# EAGLE board OBC_manufactured (EAGLE 9.7.0)
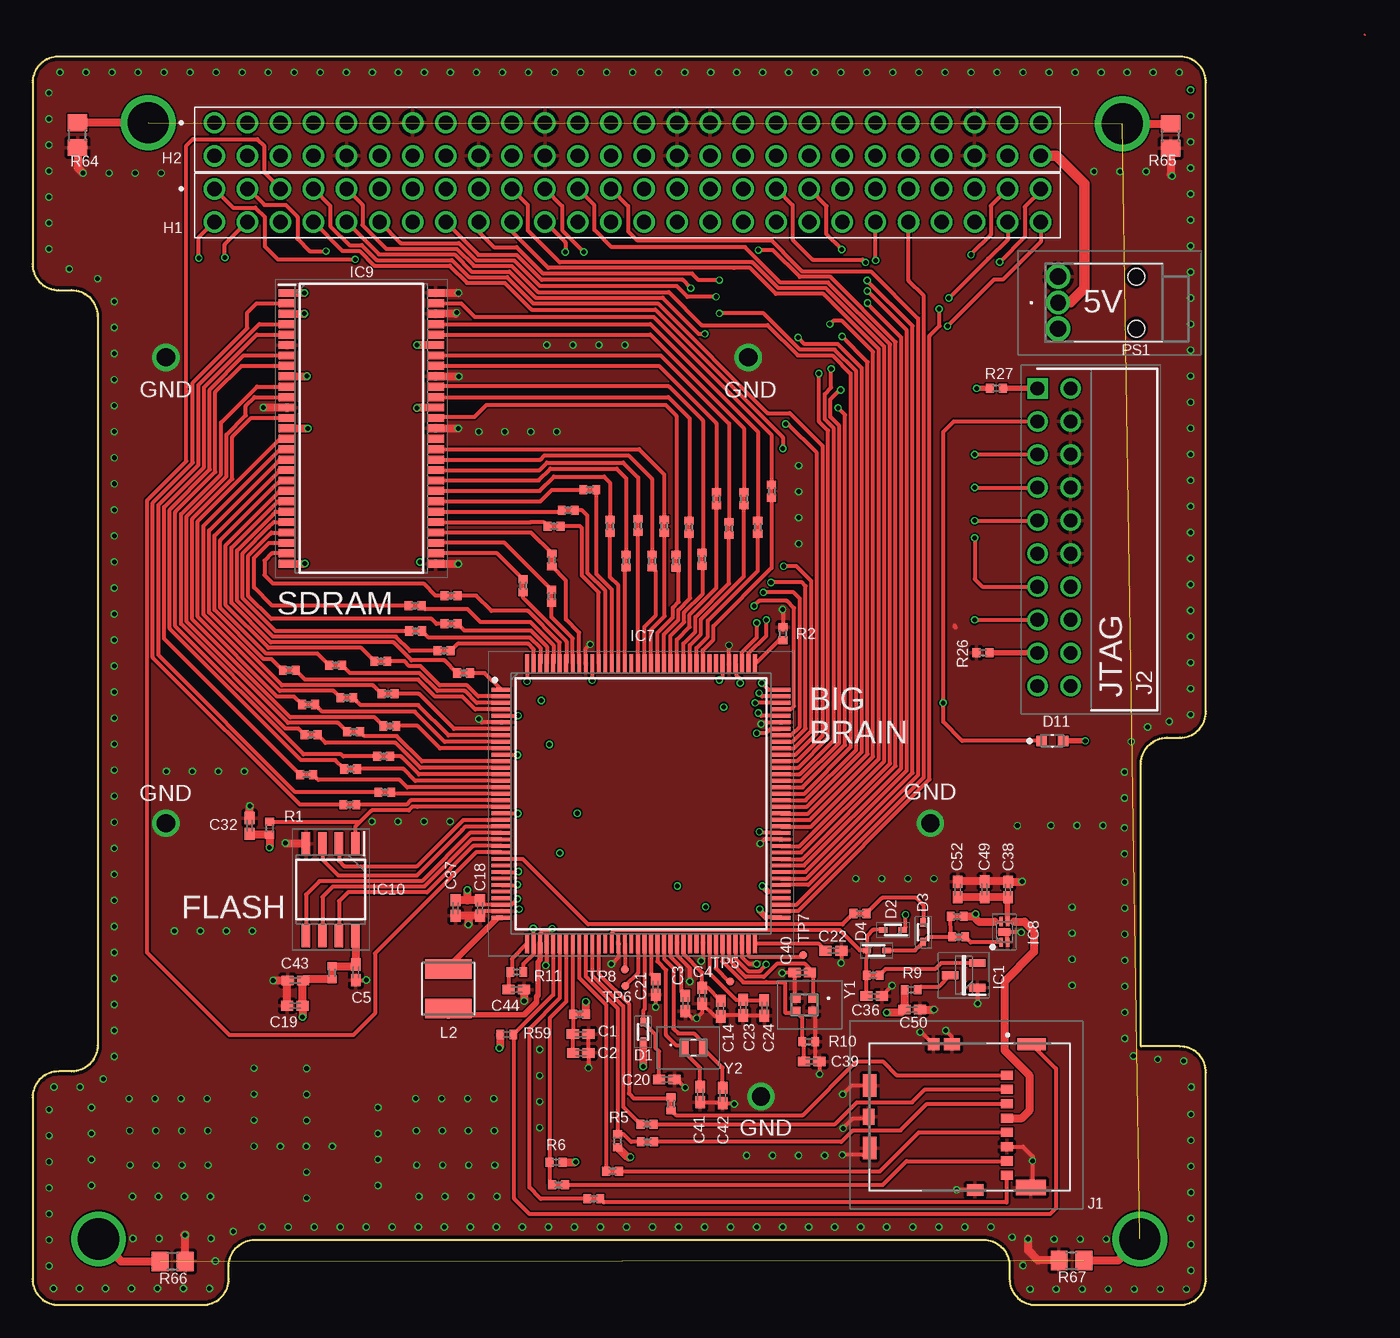
[diagram p5: board, top side]
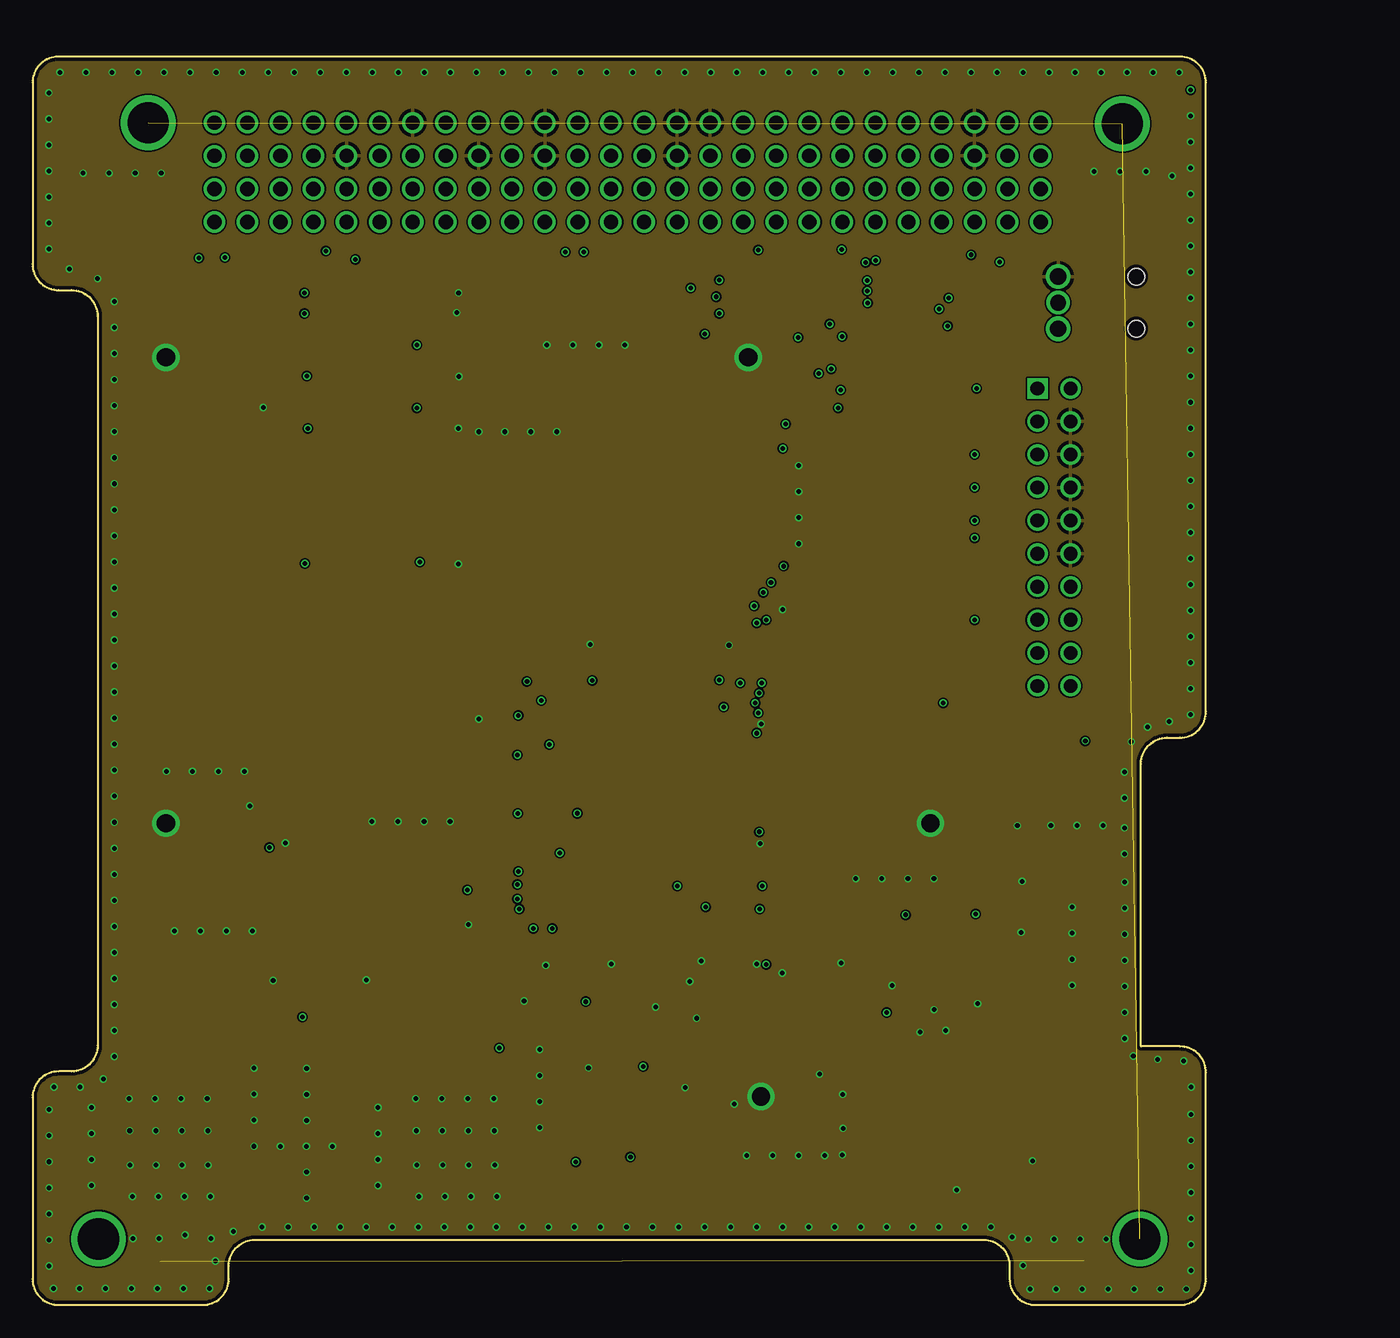
[diagram p6: board, inner layer Route2]
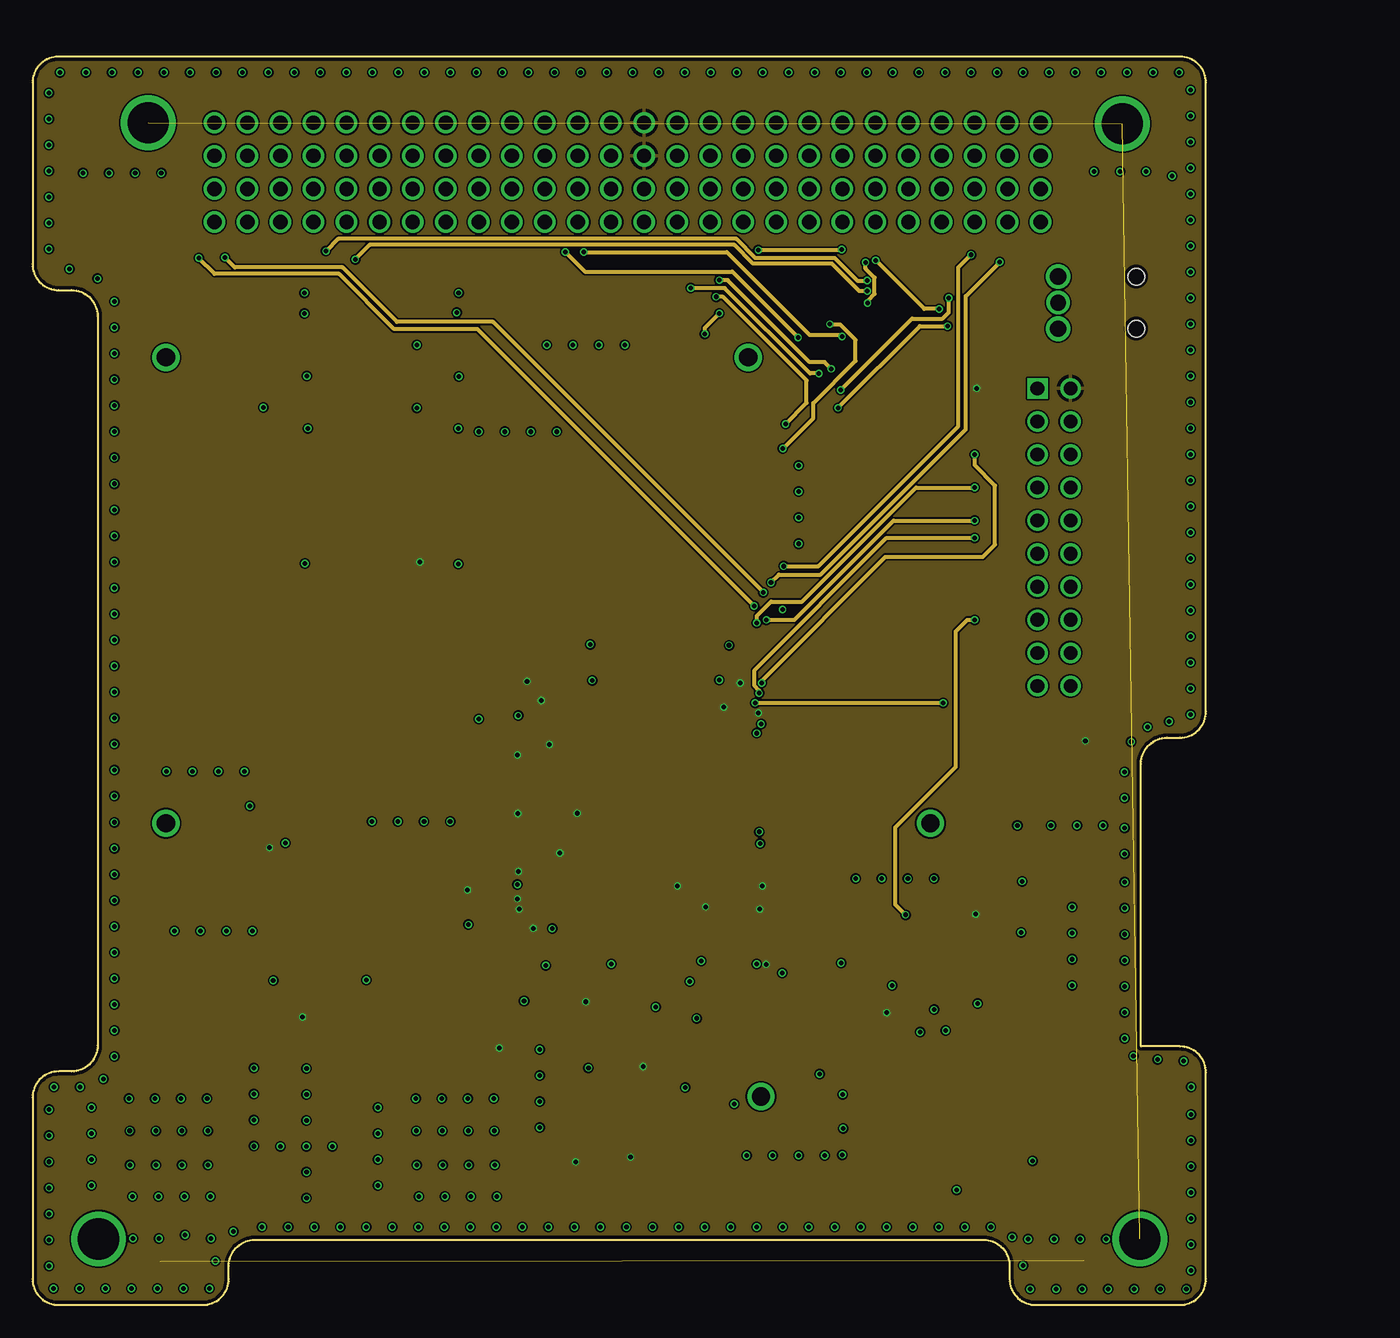
[diagram p7: board, inner layer Route15]
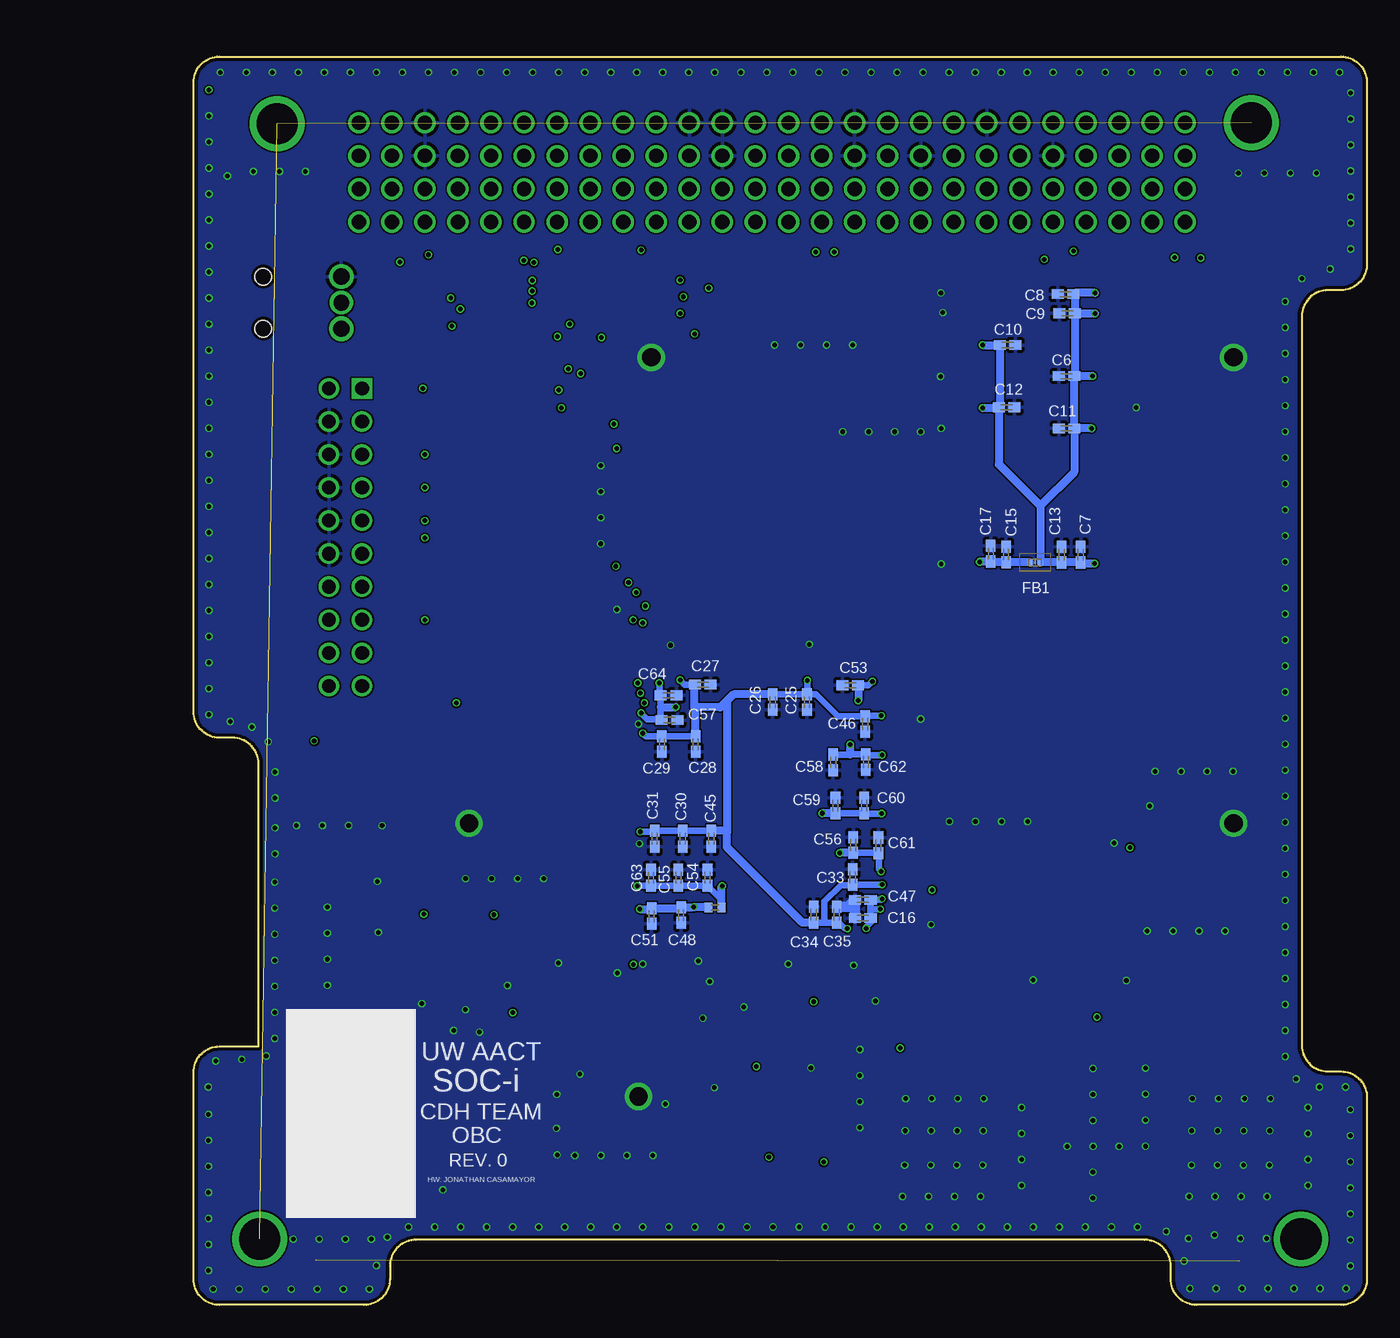
[diagram p8: board, bottom side, seen from below]

Size 90.17 x 95.89 mm. Coordinates in mm from the lower left corner, seen from the top.
Outline: 85.17,19.86 85.17,41.57 arc-90 87.17,43.57 88.17,43.57 arc90 90.17,45.57 90.17,93.89 arc90 88.17,95.89 2,95.89 arc90 0,93.89 0,79.95 arc90 2,77.95 3,77.95 arc-90 5,75.95 5,19.94 arc-90 3,17.94 2,17.94 arc90 0,15.94 0,2 arc90 2,0 13.08,0 arc90 15.08,2 15.08,3 arc-90 17.08,5 73.08,5 arc-90 75.08,3 75.08,2 arc90 77.08,0 88.17,0 arc90 90.17,2 90.17,17.86 arc90 88.17,19.86 85.17,19.86
Copper layers (1*2*15*16): Top 0.035mm / dielectric 0.23mm / Route2 0.035mm / dielectric 0.93mm / Route15 0.035mm / dielectric 0.23mm / Bottom 0.035mm
Design rules "MF_Standard_4_Layer": minimum track width 5mil, minimum drill 10mil, track to track 5mil, track to pad 5mil, pad to pad 5mil, via to via 5mil, smd to smd 0mil, copper to edge 10mil, drill to drill 10mil, minimum pad ring 4mil, minimum via ring 4mil, stop-mask expansion 2mil, vias tented up to drill 25mil, thermal gap 10mil

## Footprints (pad centres in the part's own frame; a part is rotated, then mirrored left to right if it is on the bottom)
C0402K = smd 0.925 x 0.74: 1 -0.6,0; 2 0.6,0
SODFL1608X70N = smd 0.64 x 0.42: 1 -0.75,0; 2 0.75,0
KINGBRIGHT_KPT-1608SGC_0 = smd 0.8 x 0.8: 1 -0.825,0; 2 0.825,0
NFZ15SG152SN10B = smd 0.4 x 0.5: 1 -0.4,0; 2 0.4,0
SAMTEC_ESQ-126-39-G-D = drill 1.1: 1 0,0; 2 0,-2.54; 3 2.54,0; 4 2.54,-2.54; 5 5.08,0; 6 5.08,-2.54; 7 7.62,0; 8 7.62,-2.54; 9 10.16,0; 10 10.16,-2.54; 11 12.7,0; 12 12.7,-2.54; 13 15.24,0; 14 15.24,-2.54; 15 17.78,0; 16 17.78,-2.54; 17 20.32,0; 18 20.32,-2.54; 19 22.86,0; 20 22.86,-2.54; 21 25.4,0; 22 25.4,-2.54; 23 27.94,0; 24 27.94,-2.54; 25 30.48,0; 26 30.48,-2.54; 27 33.02,0; 28 33.02,-2.54; 29 35.56,0; 30 35.56,-2.54; 31 38.1,0; 32 38.1,-2.54; 33 40.64,0; 34 40.64,-2.54; 35 43.18,0; 36 43.18,-2.54; 37 45.72,0; 38 45.72,-2.54; 39 48.26,0; 40 48.26,-2.54; 41 50.8,0; 42 50.8,-2.54; 43 53.34,0; 44 53.34,-2.54; 45 55.88,0; 46 55.88,-2.54; 47 58.42,0; 48 58.42,-2.54; 49 60.96,0; 50 60.96,-2.54; 51 63.5,0; 52 63.5,-2.54
SOT95P237X112-3N = smd 1.25 x 0.6: 1 -1.05,0.95; 2 -1.05,-0.95; 3 1.05,0
QFP50P2200X2200X160-144N = smd 1.475 x 0.3: 1 -10.738,8.75; 2 -10.738,8.25; 3 -10.738,7.75; 4 -10.738,7.25; 5 -10.738,6.75; 6 -10.738,6.25; 7 -10.738,5.75; 8 -10.738,5.25; 9 -10.738,4.75; 10 -10.738,4.25; 11 -10.738,3.75; 12 -10.738,3.25; 13 -10.738,2.75; 14 -10.738,2.25; 15 -10.738,1.75; 16 -10.738,1.25; 17 -10.738,0.75; 18 -10.738,0.25; 19 -10.738,-0.25; 20 -10.738,-0.75; 21 -10.738,-1.25; 22 -10.738,-1.75; 23 -10.738,-2.25; 24 -10.738,-2.75; 25 -10.738,-3.25; 26 -10.738,-3.75; 27 -10.738,-4.25; 28 -10.738,-4.75; 29 -10.738,-5.25; 30 -10.738,-5.75; 31 -10.738,-6.25; 32 -10.738,-6.75; 33 -10.738,-7.25; 34 -10.738,-7.75; 35 -10.738,-8.25; 36 -10.738,-8.75; 73 10.738,-8.75; 74 10.738,-8.25; 75 10.738,-7.75; 76 10.738,-7.25; 77 10.738,-6.75; 78 10.738,-6.25; 79 10.738,-5.75; 80 10.738,-5.25; 81 10.738,-4.75; 82 10.738,-4.25; 83 10.738,-3.75; 84 10.738,-3.25; 85 10.738,-2.75; 86 10.738,-2.25; 87 10.738,-1.75; 88 10.738,-1.25; 89 10.738,-0.75; 90 10.738,-0.25; 91 10.738,0.25; 92 10.738,0.75; 93 10.738,1.25; 94 10.738,1.75; 95 10.738,2.25; 96 10.738,2.75; 97 10.738,3.25; 98 10.738,3.75; 99 10.738,4.25; 100 10.738,4.75; 101 10.738,5.25; 102 10.738,5.75; 103 10.738,6.25; 104 10.738,6.75; 105 10.738,7.25; 106 10.738,7.75; 107 10.738,8.25; 108 10.738,8.75 | smd 0.3 x 1.475: 37 -8.75,-10.738; 38 -8.25,-10.738; 39 -7.75,-10.738; 40 -7.25,-10.738; 41 -6.75,-10.738; 42 -6.25,-10.738; 43 -5.75,-10.738; 44 -5.25,-10.738; 45 -4.75,-10.738; 46 -4.25,-10.738; 47 -3.75,-10.738; 48 -3.25,-10.738; 49 -2.75,-10.738; 50 -2.25,-10.738; 51 -1.75,-10.738; 52 -1.25,-10.738; 53 -0.75,-10.738; 54 -0.25,-10.738; 55 0.25,-10.738; 56 0.75,-10.738; 57 1.25,-10.738; 58 1.75,-10.738; 59 2.25,-10.738; 60 2.75,-10.738; 61 3.25,-10.738; 62 3.75,-10.738; 63 4.25,-10.738; 64 4.75,-10.738; 65 5.25,-10.738; 66 5.75,-10.738; 67 6.25,-10.738; 68 6.75,-10.738; 69 7.25,-10.738; 70 7.75,-10.738; 71 8.25,-10.738; 72 8.75,-10.738; 109 8.75,10.738; 110 8.25,10.738; 111 7.75,10.738; 112 7.25,10.738; 113 6.75,10.738; 114 6.25,10.738; 115 5.75,10.738; 116 5.25,10.738; 117 4.75,10.738; 118 4.25,10.738; 119 3.75,10.738; 120 3.25,10.738; 121 2.75,10.738; 122 2.25,10.738; 123 1.75,10.738; 124 1.25,10.738; 125 0.75,10.738; 126 0.25,10.738; 127 -0.25,10.738; 128 -0.75,10.738; 129 -1.25,10.738; 130 -1.75,10.738; 131 -2.25,10.738; 132 -2.75,10.738; 133 -3.25,10.738; 134 -3.75,10.738; 135 -4.25,10.738; 136 -4.75,10.738; 137 -5.25,10.738; 138 -5.75,10.738; 139 -6.25,10.738; 140 -6.75,10.738; 141 -7.25,10.738; 142 -7.75,10.738; 143 -8.25,10.738; 144 -8.75,10.738
SON50P160X120X60-5N = smd 0.7 x 0.3: 1 -0.8,0.25; 2 -0.8,-0.25; 3 0.8,-0.25; 4 0.8,0.25 | smd 0.55 x 0.91: 5 0,0
SOP80P1176X120-54N = smd 1.27 x 0.6: 1 -5.715,10.4; 2 -5.715,9.6; 3 -5.715,8.8; 4 -5.715,8; 5 -5.715,7.2; 6 -5.715,6.4; 7 -5.715,5.6; 8 -5.715,4.8; 9 -5.715,4; 10 -5.715,3.2; 11 -5.715,2.4; 12 -5.715,1.6; 13 -5.715,0.8; 14 -5.715,0; 15 -5.715,-0.8; 16 -5.715,-1.6; 17 -5.715,-2.4; 18 -5.715,-3.2; 19 -5.715,-4; 20 -5.715,-4.8; 21 -5.715,-5.6; 22 -5.715,-6.4; 23 -5.715,-7.2; 24 -5.715,-8; 25 -5.715,-8.8; 26 -5.715,-9.6; 27 -5.715,-10.4; 28 5.715,-10.4; 29 5.715,-9.6; 30 5.715,-8.8; 31 5.715,-8; 32 5.715,-7.2; 33 5.715,-6.4; 34 5.715,-5.6; 35 5.715,-4.8; 36 5.715,-4; 37 5.715,-3.2; 38 5.715,-2.4; 39 5.715,-1.6; 40 5.715,-0.8; 41 5.715,0; 42 5.715,0.8; 43 5.715,1.6; 44 5.715,2.4; 45 5.715,3.2; 46 5.715,4; 47 5.715,4.8; 48 5.715,5.6; 49 5.715,6.4; 50 5.715,7.2; 51 5.715,8; 52 5.715,8.8; 53 5.715,9.6; 54 5.715,10.4
SOIC127P790X216-8N = smd 1.785 x 0.65: 1 -3.532,1.905; 2 -3.532,0.635; 3 -3.532,-0.635; 4 -3.532,-1.905; 5 3.532,-1.905; 6 3.532,-0.635; 7 3.532,0.635; 8 3.532,1.905
5040771891 = smd 0.7 x 0.95: 1 -2.847,2.887; 2 -1.747,2.887; 3 -0.647,2.887; 4 0.453,2.887; 5 1.553,2.887; 6 2.653,2.887; 7 3.753,2.887; 8 4.853,2.887 | smd 0.95 x 2.17: 9 -5.222,4.787 | smd 1.19 x 2.3: 10 5.798,4.722 | smd 0.88 x 1.25: 11 5.963,0.447 | smd 1.7 x 1.03: 12 2.753,-7.663; 13 -2.047,-7.663 | smd 1.2 x 0.88: 14 0.353,-7.738 | smd 0.95 x 1.2: 15 -5.222,-1.338 | smd 0.9 x 0.9: 16 -5.222,-2.748
RHDRRA20W60P254X254_2X10_2590X = drill 1.05 pad 1.575 square: 1 0,0 | drill 1.05 pad 1.575: 2 0,2.54; 3 2.54,0; 4 2.54,2.54; 5 5.08,0; 6 5.08,2.54; 7 7.62,0; 8 7.62,2.54; 9 10.16,0; 10 10.16,2.54; 11 12.7,0; 12 12.7,2.54; 13 15.24,0; 14 15.24,2.54; 15 17.78,0; 16 17.78,2.54; 17 20.32,0; 18 20.32,2.54; 19 22.86,0; 20 22.86,2.54
SRN4026 = smd 1.5 x 3.6: 1 -1.525,0; 2 1.525,0
PJ040D = drill 1.209 pad 1.768: 1 6,-3 | drill 1.26 pad 1.768: 2 6,-5; 3 6,-1 | hole 1.3: 0,-5; 0,-1
R0402 = smd 0.6 x 0.7: 1 -0.5,0; 2 0.5,0
R0805 = smd 1.3 x 1.5: 1 -0.95,0; 2 0.95,0
TP06R = smd 0.6 x 0.6: TP 0,0
XRCGB24M000F2P01R0 = smd 0.75 x 0.7: 1 -0.675,-0.5; 2 0.675,-0.5; 3 0.675,0.5; 4 -0.675,0.5
ECS327712TR = smd 0.6 x 1.1: 1 -0.7,0; 2 0.7,0

## Placement (x,y rotation side)
C1  0.1uF  [C0402K]  42.11,20.8 180 top
C2  4.7uF  [C0402K]  42.14,19.35 180 top
C3  1.0 uF  [C0402K]  50.16,23.16 90 top
C4  0.1uF  [C0402K]  51.46,23.75 90 top
C5  1.0uF  [C0402K]  24.84,25.55 90 top
C6  4.7uF  [C0402K]  23.09,71.35 180 bottom
C7  0.1uF  [C0402K]  22,57.63 90 bottom
C8  0.1uF  [C0402K]  23.16,77.65 180 bottom
C9  0.1uF  [C0402K]  23.04,76.17 180 bottom
C10  0.1uF  [C0402K]  27.61,73.74 0 bottom
C11  0.1uF  [C0402K]  23.09,67.34 180 bottom
C12  0.1uF  [C0402K]  27.69,68.96 0 bottom
C13  0.1uF  [C0402K]  23.47,57.63 90 bottom
C14  10 uF  [C0402K]  52.88,22.76 90 top
C15  1.0uF  [C0402K]  27.74,57.66 270 bottom
C16  0.22uF  [C0402K]  38.73,29.72 0 bottom
C17  0.1uF  [C0402K]  28.91,57.71 270 bottom
C18  4.7uF  [C0402K]  34.39,30.48 90 top
C19  0.22uF  [C0402K]  20.17,22.99 0 top
C20  0.22uF  [C0402K]  48.74,17.32 180 top
C21  0.22uF  [C0402K]  47.88,24.43 90 top
C22  0.22uF  [C0402K]  61.54,27.2 180 top
C23  0.1uF  [C0402K]  54.61,22.83 90 top
C24  4.7uF  [C0402K]  56.24,22.81 90 top
C25  0.22uF  [C0402K]  43.03,46.3 90 bottom
C26  0.22uF  [C0402K]  45.67,46.3 90 bottom
C27  0.22uF  [C0402K]  51.03,47.65 180 bottom
C28  0.22uF  [C0402K]  51.59,43.08 90 bottom
C29  0.22uF  [C0402K]  54.18,43.08 90 bottom
C30  0.22uF  [C0402K]  52.58,35.81 90 bottom
C31  0.22uF  [C0402K]  54.74,35.81 90 bottom
C32  0.1uF  [C0402K]  16.69,36.8 270 top
C33  0.22uF  [C0402K]  39.52,32.87 270 bottom
C34  0.22uF  [C0402K]  42.52,29.97 270 bottom
C35  4.7uF  [C0402K]  40.74,29.97 270 bottom
C36  0.1uF  [C0402K]  64.67,23.72 180 top
C37  0.1uF  [C0402K]  32.51,30.48 90 top
C38  0.1uF  [C0402K]  74.96,31.9 270 top
C39  4.7pF  [C0402K]  59.87,18.69 180 top
C40  4.7pF  [C0402K]  59.13,25.53 0 top
C41  10pF  [C0402K]  51.31,16.15 90 top
C42  10pF  [C0402K]  53.04,16.08 90 top
C43  0.1uF  [C0402K]  20.19,24.92 0 top
C44  0.22uF  [C0402K]  37.19,24.23 180 top
C45  0.22uF  [C0402K]  50.39,35.81 90 bottom
C46  0.22uF  [C0402K]  38.56,44.63 90 bottom
C47  0.22uF  [C0402K]  38.73,31.11 0 bottom
C48  0.22uF  [C0402K]  52.7,29.95 90 bottom
C49  4.7uF  [C0402K]  73.15,31.93 270 top
C50  1.0uF  [C0402K]  67.59,22.68 180 top
C51  4.7uF  [C0402K]  54.97,29.87 90 bottom
C52  4.7uF  [C0402K]  71.09,31.9 270 top
C53  0.1uF  [C0402K]  39.7,47.6 0 bottom
C54  0.1uF  [C0402K]  50.67,32.82 270 bottom
C55  0.1uF  [C0402K]  52.91,32.82 270 bottom
C56  0.1uF  [C0402K]  39.47,35.33 270 bottom
C57  0.1uF  [C0402K]  53.59,44.93 180 bottom
C58  0.1uF  [C0402K]  41.02,41.68 90 bottom
C59  0.1uF  [C0402K]  40.84,38.35 270 bottom
C60  4.7uF  [C0402K]  38.63,38.35 270 bottom
C61  4.7uF  [C0402K]  37.54,35.31 270 bottom
C62  4.7uF  [C0402K]  38.51,41.71 90 bottom
C63  4.7uF  [C0402K]  55.02,32.82 270 bottom
C64  4.7uF  [C0402K]  53.67,46.84 180 bottom
D1  BAT54XV2T1G  [SODFL1608X70N]  46.91,20.98 270 top
D2  BAT54XV2T1G  [SODFL1608X70N]  66.12,28.8 180 top
D3  BAT54XV2T1G  [SODFL1608X70N]  68.45,28.63 270 top
D4  BAT54XV2T1G  [SODFL1608X70N]  64.87,27.23 0 top
D11  KINGBRIGHT_KPT-1608SGCKINGBRIGHT_KPT-1608SGC_0_0  [KINGBRIGHT_KPT-1608SGC_0]  78.36,43.33 0 top
FB1  BLM15AG121SN1D  [NFZ15SG152SN10B]  25.5,57.05 0 bottom
H1  ESQ-126-39-G-D  [SAMTEC_ESQ-126-39-G-D]  13.97,85.73 0 top
H2  ESQ-126-39-G-D  [SAMTEC_ESQ-126-39-G-D]  13.97,90.81 0 top
IC1  TPS3839L30DBZR  [SOT95P237X112-3N]  71.55,25.32 180 top
IC7  MIMXRT1021DAG5A  [QFP50P2200X2200X160-144N]  46.76,38.51 0 top
IC8  MIC94300YMT-TR  [SON50P160X120X60-5N]  74.68,28.65 90 top
IC9  IS42S16160J-6TL  [SOP80P1176X120-54N]  25.27,67.34 0 top
IC10  IS25LP064A-JBLE  [SOIC127P790X216-8N]  22.91,31.9 270 top
J1  504077-1891  [5040771891]  71.98,14.81 270 top
J2  PPPC102LJBN-RC  [RHDRRA20W60P254X254_2X10_2590X]  77.22,70.41 270 top
L2  SRN4026-4R7M  [SRN4026]  31.95,24.28 90 top
PS1  PJ-040D  [PJ040D]  84.81,73.99 180 top
R1  10k Ohm  [R0402]  18.21,36.63 90 top
R2  10k Ohm  [R0402]  57.66,51.56 270 top
R3  0 Ohm  [R0402]  42.04,22.33 180 top
R4  0 Ohm  [R0402]  23.01,25.53 90 top
R5  10k Ohm  [R0402]  44.96,12.62 90 top
R6  10k Ohm  [R0402]  40.23,10.97 180 top
R7  0 Ohm  [R0402]  63.58,30.07 0 top
R8  0 Ohm  [R0402]  64.59,25.32 180 top
R9  1k Ohm  [R0402]  67.51,24.21 0 top
R10  2.2M Ohm  [R0402]  59.64,20.22 0 top
R11  30k Ohm  [R0402]  37.21,25.58 0 top
R12  0 Ohm  [R0402]  56.79,62.51 90 top
R13  0 Ohm  [R0402]  55.73,59.74 90 top
R14  0 Ohm  [R0402]  54.66,61.93 90 top
R15  0 Ohm  [R0402]  53.52,59.64 90 top
R16  0 Ohm  [R0402]  52.55,61.93 90 top
R17  0 Ohm  [R0402]  51.44,57.28 90 top
R18  0 Ohm  [R0402]  50.44,59.74 90 top
R19  0 Ohm  [R0402]  49.45,57.12 90 top
R20  0 Ohm  [R0402]  48.54,59.82 90 top
R21  0 Ohm  [R0402]  47.6,57.15 90 top
R22  0 Ohm  [R0402]  46.53,59.87 90 top
R23  0 Ohm  [R0402]  45.62,57.15 90 top
R24  0 Ohm  [R0402]  44.37,59.82 90 top
R25  0 Ohm  [R0402]  42.82,62.61 180 top
R26  100 Ohm  [R0402]  73.03,50.09 180 top
R27  100 Ohm  [R0402]  74.07,70.41 0 top
R28  0 Ohm  [R0402]  41.17,61.04 180 top
R29  0 Ohm  [R0402]  40.08,59.82 180 top
R30  0 Ohm  [R0402]  39.9,57.23 90 top
R31  0 Ohm  [R0402]  39.88,54.43 90 top
R32  0 Ohm  [R0402]  37.69,55.24 90 top
R33  0 Ohm  [R0402]  24.38,38.43 0 top
R34  0 Ohm  [R0402]  27.08,39.4 0 top
R35  0 Ohm  [R0402]  21.06,40.74 0 top
R36  0 Ohm  [R0402]  24.43,41.17 0 top
R37  0 Ohm  [R0402]  26.97,42.14 0 top
R38  0 Ohm  [R0402]  21.41,43.79 0 top
R39  0 Ohm  [R0402]  24.66,44.02 0 top
R40  0 Ohm  [R0402]  27.46,44.48 0 top
R41  0 Ohm  [R0402]  21.21,46.13 0 top
R42  0 Ohm  [R0402]  24.16,46.63 0 top
R43  0 Ohm  [R0402]  27.33,46.94 0 top
R44  0 Ohm  [R0402]  19.74,48.74 0 top
R45  0 Ohm  [R0402]  23.29,49.15 0 top
R46  0 Ohm  [R0402]  26.77,49.45 0 top
R47  0 Ohm  [R0402]  33.12,48.54 0 top
R48  0 Ohm  [R0402]  31.62,50.24 0 top
R49  0 Ohm  [R0402]  29.44,51.77 0 top
R50  0 Ohm  [R0402]  32.16,52.32 0 top
R51  0 Ohm  [R0402]  29.39,53.72 0 top
R52  0 Ohm  [R0402]  32.16,54.48 0 top
R53  0 Ohm  [R0402]  49.07,15.44 270 top
R54  0 Ohm  [R0402]  47.22,13.89 0 top
R55  0 Ohm  [R0402]  47.24,12.52 0 top
R56  0 Ohm  [R0402]  44.58,10.26 0 top
R57  0 Ohm  [R0402]  40.41,9.22 0 top
R58  0 Ohm  [R0402]  43.13,8.15 0 top
R59  10k Ohm  [R0402]  36.45,20.78 180 top
R60  0 Ohm  [R0402]  71.17,28.27 0 top
R61  0 Ohm  [R0402]  71.04,29.84 0 top
R62  0 Ohm  [R0402]  50.09,30.53 180 bottom
R64  1 MOhm  [R0805]  3.45,89.86 90 top
R65  1 MOhm  [R0805]  87.45,89.79 90 top
R66  1 MOhm  [R0805]  10.77,3.35 180 top
R67  1 MOhm  [R0805]  79.83,3.43 0 top
TP5  TPTP06R  [TP06R]  53.59,24.84 90 top
TP6  TPTP06R  [TP06R]  45.54,24.51 0 top
TP7  TPTP06R  [TP06R]  59.21,26.9 0 top
TP8  TPTP06R  [TP06R]  45.52,25.78 0 top
Y1  XRCGB24M000F2P01R0  [XRCGB24M000F2P01R0]  59.31,23.06 180 top
Y2  ECS-.327-7-12-TR  [ECS327712TR]  50.8,19.76 0 top

## Tracks (layer width: path | path; a pad name or v marks a point on that pad's centre or on a via)
3V3_BUS  (via drill 0.35)
  Top 0.305: IC7.34 | R11.2 37.71,26.18 38.52,26.99 IC7.38 38.51,28.9 v38.48,28.93 | 42.54,23.27 v42.52,23.29 | 41.71,10.97 v41.73,11 | v56.36,26.16 56.21,26.01 56.21,25.96 55.88,25.64 54.98,25.64 54.02,26.6 54.02,27.76 IC7.69 54.01,27.64 | R59.2 35.92,20.75 | 35.92,19.8 v35.87,19.74 | 72.08,29.84 72.29,29.84 | 67.01,22.71 C50.2 66.76,22.45 | IC8.4 73.93,29.45 73.91,29.44 | IC7.34 34.72,30.76 C18.2 | IC7.73 57.47,29.78 56.35,29.78 | v37.26,31.19 36.83,30.76 IC7.34 | IC8.1 72.09,27.85 R60.2 R60.1 | D4.2 67.81,27.23 D3.2 68.85,28.27 R60.1 | R60.1 70.55,28.39 R61.1 R61.2 | IC7.44 41.51,22.35 R3.2 | R3.2 41.54,20.83 C1.2 41.51,19.38 C2.2 | IC7.11 37.25,42.26 v37.26,42.24 | R3.1 R3.2 | 18.2,36.12 R1.1 | IC7.77 56.51,31.76 | IC7.29 37.3,33.26 v37.34,33.3 | IC7.20 37.27,37.76 v37.29,37.74 | IC7.144 38.01,47.92 v38,47.9 | IC7.112 54.07,49.18 54.07,48.4 54.38,48.09 v54.38,47.78 | IC7.104 55.99,45.26 v55.78,45.47
  Top 0.406: 56.51,31.76 v56.08,32.18 | R27.1 v72.55,70.41 | v80.9,43.33 D11.2
  Top 0.508: 56.35,29.78 55.88,30.25 v55.88,30.4
  Top 0.61: R3.1 42.54,23.27 | R5.1 45.73,11.35 v45.95,11.35 | R6.1 41.71,10.97 | D1.2 v46.91,18.31 | 35.92,20.75 35.92,19.8 | R61.2 72.08,29.84 | v72.47,30.02 72.29,29.84 72.68,29.45 73.93,29.45 | R9.1 67.01,22.71 | 66.76,22.45 v65.63,22.45 | C18.2 33.43,31.08 | 33.43,31.08 C37.2 | 33.43,31.08 v33.43,31.88 | v20.75,22.12 20.77,22.14 C19.2 20.77,24.89 C43.2 20.9,25.03 R4.1 R4.2 24.72,26.03 C5.2 | C5.2 24.77,26.09 | IC10.8 24.82,26.18 C5.2 | v18.21,35.13 R1.1 16.77,36.13 C32.2
  Bottom 0.305: 27.73,57.05 C15.2 | 28.85,57.06 C17.2 | v29.77,57.07 29.73,57.11 | 55.03,30.4 C51.2 | 52.78,30.47 C48.2 | 51.75,30.55 v51.71,30.58 | 37.34,31.11 v37.26,31.19 | 38.13,30.4 38.12,30.4 | 38.44,42.24 C62.2 | 38.21,47.7 38.2,47.7
  Bottom 0.406: C16.2 38.1,29.68 38.1,29.41 | v38.48,28.93 38.48,29.03
  Bottom 0.508: 38.48,29.03 38.1,29.41 | C16.2 38.13,30.4 C47.2 37.34,31.11 | 38.12,30.4 v37.39,30.4 | R62.1 49.59,31.13 C54.2 C55.2 C63.2 56.05,32.22 v56.08,32.18 56.07,32.18 | C56.2 37.57,34.73 C61.2 37.52,34.68 37.52,33.48 v37.34,33.3 37.34,33.33 | C59.2 C60.2 v37.29,37.74 | v37.26,42.24 38.44,42.24 | C62.2 39.7,42.31 | C58.2 39.7,42.28 | 54.27,45.01 54.27,45.92 C64.2 54.37,46.94 54.37,47.77 v54.38,47.78 54.38,47.74 | 54.27,45.01 C57.2 | v38,47.9 38.2,47.7 | 55.77,45.47 v55.78,45.47 55.32,45.01 54.27,45.01 | C53.2 38.31,47.6 38.21,47.7
  Bottom 0.61: FB1.1 27.73,57.05 | C15.2 28.85,57.06 | 29.73,57.11 C17.2 | v55.88,30.4 55.03,30.4 | C51.2 52.78,30.47 | C48.2 51.75,30.55 50.6,30.55 R62.2 | 39.7,42.28 39.7,42.31 39.7,43.03 v39.73,43.05 | C53.2 v39.09,46.43 | R62.1 49.59,32.15 v49.55,32.18 | 54.27,45.92 v53.11,45.92 | C59.2 41.84,37.75 v41.86,37.77 | C56.2 40.5,34.73 v40.51,34.72
  pour Route15: 389 corners
5V_USB
  Top 0.61: PS1.1 78.84,77.02
  Top 0.813: 78.84,77.02 79.75,77.02 80.82,78.08 80.82,86.11 78.66,88.27 H2.52
5V_USB_OTG
  Top 0.305: IC7.59 49.01,26.76 49.84,25.93 49.84,24.09 C3.2
ANT_BURN_WIRE1
  Top 0.305: IC7.83 57.51,34.77 59.06,34.77 65.89,41.59 65.89,73.79 61.14,78.54 57.48,78.54 54.76,81.25 44.5,81.25 43.18,82.58 43.18,84.46 H1.23
ANT_BURN_WIRE2
  Top 0.305: IC7.78 59.62,32.27 68.05,40.7 68.05,75.77 64.41,79.4 59.13,79.4 57.68,80.85 57.68,80.89 56.79,81.79 46.46,81.79 45.77,82.47 45.77,84.41 H1.25
CHASSIS  (via drill 3.18)  (3 unrouted)
  Top 0.61: v5.08,5.08 6.81,3.35 R66.2 | v85.09,5.08 83.41,3.4 80.81,3.4 R67.2 | v83.74,90.73 R65.2 | v8.89,90.81 R64.2
DCDC_OUT  (via drill 0.35)
  Top 0.305: v39.93,28.91 39.81,28.79 39.25,28.79 39.01,28.55 IC7.39 | IC7.86 55.95,36.26 v55.85,36.35 | IC7.102 57.43,44.19 56.65,44.19 56.38,43.92 v55.65,43.92 | IC7.31 37.23,32.26 v37.26,32.28 | IC7.5 v37.31,45.26 | IC7.134 43.01,47.99 v43,47.98 | IC7.114 53.01,48.24 v52.78,48.01
  Top 0.406: IC7.39 39.01,26.51 38.84,26.34 38.84,23.78 38.73,23.67 38.73,23.26 37.77,22.29 31.95,22.29
  Top 0.61: 31.95,22.29 L2.1
  Bottom 0.305: 54.8,36.35 C31.2 | 38.52,45.26 C46.2 | 43,46.93 C25.2
  Bottom 0.406: v39.93,28.91 40.1,28.91 40.56,29.37 C35.2
  Bottom 0.508: C35.2 41.68,29.37 | 41.68,29.37 C34.2 | v55.85,36.35 54.8,36.35 | C31.2 C30.2 C45.2 | v55.65,43.92 55.41,43.68 C29.2 C28.2 | v37.26,32.28 38.11,32.28 C33.2 39.54,32.25 40.44,32.25 41.68,31 41.68,29.37 | v37.31,45.26 38.52,45.26 | v43,47.98 43,46.93 | C26.2 C25.2 42.33,46.9 40.66,45.23 C46.2 | v52.78,48.01 52.43,47.65 C27.2
  Bottom 0.61: C28.2 51.59,45.9 | C27.2 51.69,47.59 51.69,45.9 51.59,45.9 | C26.2 48.68,46.9 49.19,46.39 | 51.59,45.9 49.68,45.9 49.19,46.39 | C34.2 43.4,29.37 49.19,35.16 49.19,36.23 | C45.2 50.38,36.42 49.38,36.42 49.19,36.23 | 49.19,46.39 49.19,36.23
DTR
  Top 0.305: IC7.26 34.08,34.76 26.31,27 26.31,22.4 24.64,20.73 15.14,20.73 8.81,27.05 8.81,61.82 11.81,64.81 11.81,89.05 12.32,89.56 17.27,89.56 17.78,89.05 17.78,87 H1.5
FLEXSPI_CLK
  Top 0.305: IC7.24 33.73,35.76 30.1,32.13 23.06,32.13 22.28,31.34 IC10.6
FLEXSPI_D0_A
  Top 0.305: IC7.23 33.62,36.26 29.92,32.56 22.05,32.56 21.01,31.52 IC10.5
FLEXSPI_D1_A
  Top 0.305: IC10.2 23.55,34.11 23.95,33.71 29.57,33.71 33.12,37.26 IC7.21
FLEXSPI_D2_A
  Top 0.305: IC10.3 22.28,34.21 23.5,32.99 29.54,32.99 32.99,36.45 32.99,36.47 33.28,36.76 IC7.22
FLEXSPI_D3_A
  Top 0.305: IC7.25 33.86,35.26 30.3,31.7 24.23,31.7 23.55,31.01 IC10.7
FLEXSPI_SS0
  Top 0.305: IC7.19 29.56,38.26 29.54,38.28 29.19,38.28 28.91,38 26.06,38 25.34,37.27 25.19,37.13 | IC10.1 24.82,36.75 25.19,37.13 | R1.2 25.19,37.13
GND  (via drill 0.35, 1.4)
  Top 0.305: IC7.135 42.51,50.41 v42.85,50.75 | 32.54,76.19 32.55,76.19 v32.59,76.22 | 32.73,77.73 v32.74,77.75 | 32.7,56.94 v32.72,56.92 | v57.63,53.42 57.66,53.39 R2.1 | IC7.113 v53.51,50.67 v53.52,50.67 | IC7.6 34.54,44.76 v34.29,45.01 | v17.73,68.94 | 19.48,35.43 v19.43,35.48 | C5.1 25.64,24.95 v25.65,24.97 | 37.79,23.36 v37.77,23.34 | IC8.2 74.93,28.4 IC8.5 75.95,28.65 v75.97,28.63 | C38.1 74.98,32.53 | C49.1 73.18,32.55 | C1.1 42.74,20.78 C2.1 42.74,18.23 v42.72,18.21 | IC7.51 45.01,26.72 v44.48,26.19 | C21.1 v47.88,22.89 | 51.28,15.58 C41.1 52.96,15.55 C42.1 53.89,15.48 v53.92,15.44 | IC7.60 49.53,27.75 49.53,26.86 50.49,25.89 v50.49,24.84 | IC7.70 54.5,26.73 54.91,26.32 55.03,26.2 v55.65,26.2 | C20.1 49.51,17.32 v50.14,16.69 | C3.1 50.71,22.02 v51.03,22.02 51.46,22.45 C4.1 52.45,22.16 C14.1 52.96,22.23 C23.1 54.63,22.21 C24.1 | IC7.64 51.51,26.54 v51.38,26.42 | Y1.4 60.14,22.41 R10.2 60.14,19.02 C39.1 60.47,17.74 v60.48,17.73 | Y1.2 58.53,23.67 C40.1 57.63,25.53 v57.61,25.5 | J1.13 62.93,16.86 v62.26,16.18 | J1.14 64.09,14.3 63.02,14.3 v62.28,13.56 | J1.12 63.8,11.53 v62.23,11.53 | J1.10 76.83,9.14 v76.83,11.07 76.83,11.43 76.11,12.15 J1.6 | J1.11 v71.02,8.85 v71.02,8.84 | J1.16 68.31,20.95 v68.2,20.95 | J1.15 70.65,20.62 v70.18,21.08 | IC7.40 39.51,26.15 v39.45,26.09 | C22.1 62.14,26.28 v62.13,26.26 | 71.12,32.53 C52.1 | 76.01,32.5 v76.05,32.54 | IC1.1 72.6,23.16 v72.62,23.14 | C36.1 65.27,23.75 66.04,24.52 v66.04,24.54 | IC7.103 56.11,44.76 v55.98,44.63 | IC7.85 56.23,35.76 v55.91,35.43 | IC7.35 34.77,30.26 C18.1 | 70.87,52.2 70.87,52.07 70.92,52.02
  Top 0.61: IC9.41 v32.72,67.33 | IC9.46 32.75,71.33 v32.77,71.32 | 32.54,76.19 32.49,76.14 IC9.52 | IC9.54 32.73,77.73 | IC9.28 32.7,56.94 | IC9.12 v17.73,68.94 | IC10.4 19.48,35.43 | C44.1 37.79,23.36 | 74.98,32.53 C49.1 71.12,32.53 | C38.1 76.01,32.5 | C50.1 v69.27,22.68 | v18.49,24.92 C43.1 19.57,24.89 C19.1 | C32.1 v16.69,38.33 | C18.1 33.5,29.88 | 33.5,29.88 C37.1 | 33.5,29.88 v33.5,29.21 | R66.1 v11.72,5.37 | R64.1 3.46,87.37 v3.89,86.94 | R65.1 87.45,86.82 v87.56,86.71 | R67.1 77.26,3.43 76.51,4.19 v76.51,5.05
  Top 0.691: v11.72,5.37
  Bottom 0.813: C35.1 39.88,30.57 C47.1 C16.1
  other vias: 29.69,8.33 10.25,72.79 10.25,37 69,37 55.97,16.02 55,72.79 31.69,8.33 33.69,8.33 35.69,8.33 8.11,94.68 6.11,94.68 4.11,94.68 2.11,94.68 1.25,93.11 1.25,91.11 1.25,89.11 5.89,86.94 7.89,86.94 9.89,86.94 1.25,87.11 1.25,85.11 1.25,83.11 1.25,81.11 6.28,73.08 6.28,71.08 6.28,69.08 6.28,67.08 81.56,87.07 83.56,87.07 85.56,87.07 88.98,91.34 88.98,89.34 88.98,87.34 88.98,85.34 39.52,73.73 41.52,73.73 43.52,73.73 45.52,73.73 34.29,67.08 36.29,67.08 38.29,67.08 40.29,67.08 58.88,58.47 58.88,60.47 58.88,62.47 58.88,64.47 6.28,41.08 6.28,39.08 6.28,37.08 6.28,35.08 6.28,33.08 6.28,31.08 6.28,29.08 6.28,27.08 6.28,65.08 6.28,63.08 6.28,61.08 6.28,59.08 24.11,94.68 22.11,94.68 20.11,94.68 18.11,94.68 32.11,94.68 30.11,94.68 28.11,94.68 26.11,94.68 48.11,94.68 46.11,94.68 44.11,94.68 42.11,94.68 64.11,94.68 62.11,94.68 60.11,94.68 58.11,94.68 72.11,94.68 70.11,94.68 68.11,94.68 66.11,94.68 80.11,94.68 78.11,94.68 76.11,94.68 74.11,94.68 88.98,75.34 88.98,73.34 88.98,71.34 88.98,69.34 88.98,67.34 88.98,65.34 88.98,63.34 88.98,61.34 88.98,59.34 88.98,57.34 88.98,55.34 88.98,53.34 88.98,51.34 88.98,49.34 88.98,47.34 88.98,45.34 78.25,36.83 80.25,36.83 82.25,36.83 83.93,26.48 83.93,24.48 83.93,22.48 83.93,20.48 79.88,30.56 79.88,28.56 79.88,26.56 79.88,24.56 69.27,32.75 67.27,32.75 65.27,32.75 63.27,32.75 54.86,11.48 56.86,11.48 58.86,11.48 60.86,11.48 51.64,5.99 49.64,5.99 47.64,5.99 45.64,5.99 89.01,8.64 89.01,6.64 89.01,4.64 89.01,2.64 84.59,19.12 89.03,16.74 88.66,1.21 86.66,1.21 84.66,1.21 67.64,5.99 65.64,5.99 63.64,5.99 61.64,5.99 43.64,5.99 41.64,5.99 39.64,5.99 37.64,5.99 35.64,5.99 33.64,5.99 31.64,5.99 29.64,5.99 29.52,10.74 31.52,10.74 33.52,10.74 35.52,10.74 29.49,13.38 31.49,13.38 33.49,13.38 35.49,13.38 29.44,15.84 31.44,15.84 33.44,15.84 35.44,15.84 38.97,13.62 38.97,15.62 38.97,17.62 38.97,19.62 26.55,9.17 26.55,11.17 26.55,13.17 26.55,15.17 21.06,8.21 21.06,10.21 21.06,14.17 21.06,16.17 21.06,18.17 17.02,12.19 17.02,14.19 17.02,16.19 17.02,18.19 19.64,5.99 17.64,5.99 15.42,5.63 14.05,3.38 13.6,1.26 11.6,1.26 9.6,1.26 7.72,5.1 9.72,5.1 13.72,5.1 7.49,10.74 9.49,10.74 11.49,10.74 13.49,10.74 7.67,8.33 9.67,8.33 11.67,8.33 13.67,8.33 7.47,13.38 9.47,13.38 11.47,13.38 13.47,13.38 7.42,15.84 9.42,15.84 11.42,15.84 13.42,15.84 4.53,9.17 4.53,11.17 4.53,13.17 4.53,15.17 7.6,1.26 5.6,1.26 3.6,1.26 1.6,1.26 1.28,9 1.28,7 1.28,5 1.28,3 1.28,15 1.28,13 1.28,11 1.65,16.75 3.65,16.75 6.28,25.08 6.28,23.08 6.28,21.08 6.28,19.08 5.44,17.35 10.9,28.72 12.9,28.72 14.9,28.72 16.9,28.72 26.09,37.13 28.09,37.13 30.09,37.13 32.09,37.13 10.29,40.99 12.29,40.99 14.29,40.99 16.29,40.99 6.28,49.08 6.28,47.08 6.28,45.08 6.28,43.08 6.28,57.08 6.28,55.08 6.28,53.08 6.28,51.08 6.28,77.08 6.28,75.08 5,78.84 2.82,79.57 87.35,44.82 85.68,44.39 83.93,32.48 83.93,30.48 83.93,28.48 89.01,14.64 89.01,12.64 89.01,10.64 83.9,40.94 83.9,38.94 82.66,1.21 80.66,1.21 78.66,1.21 76.66,1.21 88.98,83.34 88.98,81.34 88.98,79.34 88.98,77.34 59.64,5.99 57.64,5.99 55.64,5.99 53.64,5.99 27.64,5.99 25.64,5.99 23.64,5.99 21.64,5.99 88.11,94.68 86.11,94.68 84.11,94.68 82.11,94.68 56.11,94.68 54.11,94.68 52.11,94.68 50.11,94.68 40.11,94.68 38.11,94.68 36.11,94.68 34.11,94.68 16.11,94.68 14.11,94.68 12.11,94.68 10.11,94.68 19.04,12.19 21.04,12.19 23.04,12.19 78.51,5.05 80.51,5.05 82.51,5.05 73.64,5.99 71.64,5.99 69.64,5.99 75.27,5.2 76.1,3.03 83.9,36.65 83.9,34.65 88.46,18.74 86.46,18.87 84.43,43.26 75.68,36.81
  pour Bottom: 389 corners
  pour Route2: 389 corners
  pour Top: 389 corners
GND94  (via drill 0.35)
  other vias: 88.98,93.34
GPANAIO
  Top 0.305: IC7.71 55.01,26.83 55.09,26.75 59.06,26.75 TP7.TP
I2C1_SCL
  Top 0.305: IC7.75 58.71,30.75 68.48,40.52 68.48,77.52 67.31,78.69 H1.44
I2C1_SDA  (via drill 0.35)
  Top 0.305: IC7.74 57.51,30.27 58.84,30.27 68.94,40.37 68.94,74.45 69.7,75.21 69.7,76.48 v69.67,76.5 | v64.8,80.24 64.77,80.26 H1.42
  Route15 0.305: v69.67,76.5 68.53,76.5 v64.8,80.24
I2C2_SCL  (via drill 0.35)
  Top 0.305: IC7.82 57.51,34.25 59.16,34.25 66.32,41.41 66.32,73.97 61.32,78.97 58.95,78.97 56.9,81.03 v55.78,81.03 | H1.37 61.01,84.41 61.01,82.25 v62.18,81.08
  Route15 0.305: v55.78,81.03 62.13,81.03 v62.18,81.08
I2C2_SDA  (via drill 0.35)
  Top 0.305: IC7.81 59.28,33.77 66.75,41.23 66.75,74.31 64.16,76.9 v64.16,76.96 | H1.35 58.4,84.48 58.4,81.84 59.94,80.29 63.8,80.29 v64.01,80.09
  Route15 0.305: v64.01,80.09 64.01,79.6 64.7,78.91 64.7,77.66 64.16,77.11 v64.16,76.96
I2C3_SCL  (via drill 0.35)
  Top 0.305: IC7.100 57.51,43.27 58.4,43.27 59.41,44.27 59.41,55.22 59.13,55.5 v56.74,55.5 | H1.51 77.47,85.57 76.25,84.35 76.25,82.04 v74.32,80.11
  Route15 0.305: v56.74,55.5 57.35,56.11 60.55,56.11 71.7,67.26 71.7,77.5 v74.32,80.11
I2C3_SDA  (via drill 0.35)
  Top 0.305: IC7.99 57.51,42.75 58.49,42.75 59.84,44.09 59.84,55.6 58.7,56.74 v57.71,56.74 | H1.49 73.64,84.44 73.64,82.22 72.11,80.7 v72.11,80.67
  Route15 0.305: v57.71,56.74 60.38,56.74 71.14,67.51 71.14,79.7 v72.11,80.67
JTAG_DACK
  Top 0.406: R26.1 J2.17
JTAG_MOD
  Top 0.305: R2.2 57.35,51.06 55.54,49.24 IC7.109
JTAG_NSRST  (via drill 0.35)
  Top 0.305: D2.1 67.08,29.02 v67.08,29.97 | v72.4,52.63 J2.15
  Route15 0.305: v67.08,29.97 66.29,30.76 66.29,36.68 70.94,41.33 70.94,51.74 71.83,52.63 v72.4,52.63
JTAG_NTRST  (via drill 0.35)
  Top 0.305: IC7.106 55.65,46.26 55.65,46.25 v55.52,46.25 | D11.1 71.42,43.33 69.98,44.78 v69.98,46.25 69.98,67.06 70.79,67.87 J2.3
  Route15 0.305: v55.52,46.25 v69.98,46.25
JTAG_TCK  (via drill 0.35)
  Top 0.305: IC7.110 55.03,49.26 55.03,50.04 56.39,51.4 v56.39,52.63 | v72.4,60.25 J2.9
  Route15 0.305: v56.39,52.63 58.55,52.63 66.17,60.25 v72.4,60.25
JTAG_TDI  (via drill 0.35)
  Top 0.305: IC7.108 56.55,47.26 v56.03,47.78 | v72.4,65.33 J2.5
  Route15 0.305: v56.03,47.78 56.03,47.95 65.53,57.46 73.01,57.46 73.97,58.41 73.97,62.94 72.4,64.51 v72.4,65.33
JTAG_TDO  (via drill 0.35)
  Top 0.305: IC7.107 56.06,46.76 v55.83,46.99 | v72.4,58.93 72.4,55.75 72.97,55.17 J2.13
  Route15 0.305: v55.83,46.99 55.83,47.19 55.48,47.55 55.48,48.77 65.63,58.93 v72.4,58.93
JTAG_TMS  (via drill 0.35)
  Top 0.305: IC7.111 54.5,49.25 54.5,50.13 55.65,51.28 v55.65,52.4 | v72.4,62.79 J2.7
  Route15 0.305: v55.65,52.4 55.65,52.93 56.74,54.03 59.13,54.03 67.89,62.79 v72.4,62.79
N$1
  Top 0.406: R27.2 J2.1
N$3
  Top 0.305: R9.2 68.27,24.46 69.64,24.46 IC1.3
N$27
  Top 0.152: 102.36,97.59 102.39,97.56
N$36
  Top 0.406: IC7.36 35.72,29.76 31.95,25.98
  Top 0.61: L2.2 31.95,25.98
N$41
  Top 0.305: IC7.37 36.83,26.59 36.83,25.7 R11.1 36.59,25.45 C44.2
N$59
  Top 0.305: IC7.55 47.01,22.68 46.91,22.58 D1.1 46.91,21.7 47.88,20.74 47.88,19.74 48.14,19.47 C20.2
NVCC_PLL
  Top 0.305: C22.2 60.38,27.77 IC7.72
PMIC_STBY_REQ
  Top 0.305: IC7.54 46.51,25.48 TP6.TP
POR_B
  Top 0.305: IC7.50 44.51,28.55 44.76,28.8 62,28.8 63.58,27.23 D4.1 | D4.1 64.12,26.68 64.06,26.62 64.06,25.36 R8.2 | C36.2 64.07,25.3 R8.2 | D2.2 64.59,28.8 64.12,28.33 D4.1 | IC1.2 69.83,26.27 69.37,25.81 65.58,25.81 R8.1 R8.2
RTC_XTALI
  Top 0.305: IC7.57 48.01,26.39 48.68,25.72 48.68,20.73 49.49,19.91 49.91,19.91 49.91,19.76 | Y2.1 49.91,19.76 | C41.2 51.31,18.21 49.91,19.61 49.91,19.76
RTC_XTALO
  Top 0.305: IC7.58 48.53,27.75 48.53,26.59 49.25,25.87 49.25,21.22 49.62,20.85 50.83,20.85 51.5,20.18 Y2.2 53.03,18.23 C42.2
SD1_CLK
  Top 0.305: IC7.45 42.01,25.12 44.08,23.05 R56.1 R56.2 65.1,10.26 68.09,13.26 J1.5
SD1_CMD
  Top 0.305: IC7.46 42.51,25.23 44.96,22.79 R5.2 45.4,13.12 46,12.52 R55.1 R55.2 62.15,12.52 63.04,13.41 66.7,13.41 68.74,15.46 J1.3
SD1_D0
  Top 0.305: IC7.43 41.01,23.31 39.73,22.03 R6.2 39.73,9.4 R57.1 R57.2 65.33,9.22 67.16,11.05 J1.7
SD1_D1
  Top 0.305: IC7.42 40.51,23.57 38.18,21.23 38.18,9.03 39.05,8.15 R58.1 R58.2 43.91,7.87 74.87,7.87 J1.8
SD1_D2
  Top 0.305: IC7.48 43.51,25.45 45.82,23.14 45.82,16.26 46.24,15.84 48.97,15.84 R53.1 R53.2 49.44,14.58 59.18,14.58 63.32,18.72 65.33,18.72 66.39,17.66 J1.1
SD1_D3
  Top 0.305: IC7.47 43.01,25.34 45.39,22.96 45.39,15.22 R54.1 R54.2 61.67,13.89 63.35,15.57 67.59,15.57 68.57,16.55 J1.2
SD_CD_SW
  Top 0.305: J1.9 78.64,18.16 78.64,7.44 78.18,6.99 38.2,6.99 37.01,8.18 37.01,20.78 R59.1 36.97,20.78 40.01,23.81 IC7.41
SD_PWREN
  Top 0.305: D3.1 68.45,30.72 67.91,31.27 65.27,31.27 R7.2 R7.1 62.24,29.23 42.7,29.23 37.67,34.27 37.66,34.26 IC7.27
SDRAM_3V3  (via drill 0.35)
  Top 0.305: 20.92,56.94 v20.93,56.95
  Top 0.61: IC9.27 20.92,56.94 | IC9.1 20.89,77.73 v20.9,77.75 | IC9.9 21.07,71.33 v21.08,71.35 | IC9.14 v21.16,67.33 | IC9.49 v29.54,73.73 v29.54,73.74 | IC9.43 29.57,68.94 v29.54,68.91 | IC9.3 20.89,76.14 v20.9,76.15
  Bottom 0.305: 21.91,56.95 C7.1 | 25.09,57.03 FB1.2
  Bottom 0.61: v20.93,56.95 21.91,56.95 | C7.1 C13.1 25.09,57.03 25.09,61.38 | v20.9,77.75 22.46,77.75 C8.1 22.44,77.52 C9.1 | v21.08,71.35 C6.1 | C9.1 22.44,71.4 C6.1 | v21.16,67.33 C11.1 | C11.1 22.49,63.97 25.09,61.38 | v29.54,73.74 C10.1 28.21,69.04 C12.1 | v29.54,68.91 28.34,68.91 C12.1 | C12.1 28.29,64.58 25.09,61.38 | v20.9,76.15 22.41,76.15 C9.1 | C11.1 C6.1
SEMC_A0
  Top 0.305: IC7.142 39.02,49.25 39.02,50.47 38.23,51.26 30.45,51.26 R49.2 R49.1 18.67,51.77 16.15,54.28 16.15,57.76 18.16,59.77 18.53,60.13 IC9.23
SEMC_A1
  Top 0.305: IC7.141 39.52,49.25 39.52,50.58 38.3,51.79 33.19,51.79 R50.2 R50.1 31.04,52.32 30.66,52.7 18.34,52.7 16.59,54.46 16.59,57.56 18.26,59.23 18.26,59.26 18.34,59.34 IC9.24
SEMC_A2
  Top 0.305: IC7.140 40.03,49.26 40.03,50.68 38.26,52.45 34.42,52.45 33.42,53.45 30.16,53.45 R51.2 R51.1 18.41,53.72 17.02,55.12 17.02,57.38 18.18,58.53 IC9.25
SEMC_A3
  Top 0.305: IC7.139 40.51,50.88 38.08,53.31 35.26,53.31 34.09,54.48 R52.2 R52.1 30.99,54.48 30.05,55.42 18.47,55.42 17.83,56.06 17.83,57.17 18.39,57.73 IC9.26
SEMC_A4
  Top 0.305: IC7.138 41.02,49.25 41.02,50.98 37.69,54.31 R32.1 R32.2 35.7,57.73 IC9.29
SEMC_A5
  Top 0.305: IC7.137 41.51,51.2 39.88,52.83 R31.1 R31.2 36.27,58.53 IC9.30
SEMC_A6
  Top 0.305: IC7.136 42.01,51.64 41,52.65 41,55.63 R30.1 R30.2 38.29,59.34 IC9.31
SEMC_A7
  Top 0.305: IC7.133 43.51,54.73 42.22,56.03 42.22,59.66 42.06,59.82 R29.1 R29.2 39.25,60.15 38.3,60.15 38.29,60.13 IC9.32
SEMC_A8
  Top 0.305: IC7.132 44.01,54.84 42.65,56.21 42.65,60.63 42.24,61.04 R28.1 R28.2 40.57,60.94 IC9.33
SEMC_A9
  Top 0.305: IC7.131 44.51,54.95 43.32,56.14 R25.1 R25.2 39.9,62.61 39.03,61.73 IC9.34
SEMC_A10
  Top 0.305: IC7.143 38.51,50.36 38.1,50.77 32.66,50.77 R48.2 R48.1 29.01,50.24 27.91,51.33 18.49,51.33 15.72,54.1 15.72,57.94 18.49,60.71 18.49,60.76 18.67,60.94 IC9.22
SEMC_A11
  Top 0.305: IC7.130 45.01,55.27 44.37,55.91 R24.1 R24.2 44.37,63.17 43.92,63.63 40.06,63.63 38.96,62.53 IC9.35
SEMC_A12
  Top 0.305: IC7.129 45.51,56.54 R23.1 R23.2 45.62,63.5 44.88,64.24 39.8,64.24 38.9,63.34 IC9.36
SEMC_BA0
  Top 0.305: IC7.2 34.24,46.76 33.4,47.6 31.29,47.6 29.81,49.08 28.95,49.08 28.57,49.45 R46.2 R46.1 25.26,50.47 18.13,50.47 14.86,53.74 14.86,58.37 18.9,62.41 18.9,62.43 19,62.53 IC9.20
SEMC_BA1
  Top 0.305: IC7.1 34.74,48.54 R47.2 R47.1 31.65,49.51 29.13,49.51 27.74,50.9 18.31,50.9 15.29,53.92 15.29,58.17 18.8,61.67 18.8,61.7 18.84,61.73 IC9.21
SEMC_CAS
  Top 0.305: IC7.7 32.38,44.26 29.69,46.94 R43.2 R43.1 26.17,47.6 19.17,47.6 13.56,53.21 13.56,59.47 18.9,64.81 18.9,64.82 19.01,64.94 IC9.17
SEMC_CKE
  Top 0.305: IC7.127 46.51,59.35 R22.1 R22.2 46.53,63.55 45.39,64.69 39.52,64.69 38.96,64.14 IC9.37
SEMC_CLK
  Top 0.305: IC7.126 47.01,52.09 47.9,52.98 47.9,56.34 R21.1 R21.2 47.6,63.45 45.8,65.25 39.34,65.25 39.02,64.94 IC9.38
SEMC_CS0
  Top 0.305: IC7.3 34.13,46.26 33.22,47.17 31.11,47.17 29.74,48.54 24.4,48.54 R45.2 R45.1 21.9,50.04 17.95,50.04 14.43,53.56 14.43,58.73 18.81,63.12 18.84,63.12 19.06,63.34 IC9.19
SEMC_D0
  Top 0.305: IC7.18 29.05,38.76 28.73,38.43 R33.2 R33.1 20.55,38.43 9.25,49.73 9.25,61.64 12.32,64.71 12.32,70.84 16.51,75.04 16.51,76.22 17.22,76.94 IC9.2
SEMC_D1
  Top 0.305: IC7.17 27.71,39.26 R34.2 R34.1 20.19,39.4 9.68,49.91 9.68,61.46 12.75,64.53 12.75,70.67 17.42,75.33 IC9.4
SEMC_D2
  Top 0.305: IC7.16 28.8,39.76 28.22,40.34 21.96,40.34 R35.2 R35.1 10.11,51.19 10.11,61.28 13.18,64.35 13.18,70.49 17.23,74.53 IC9.5
SEMC_D3
  Top 0.305: IC7.15 29.42,40.26 28.5,41.17 R36.2 R36.1 23.25,41.85 20.64,41.85 10.54,51.95 10.54,61.1 13.61,64.17 13.61,70.31 16.24,72.94 IC9.7
SEMC_D4
  Top 0.305: IC7.14 29.7,40.76 28.32,42.14 R37.2 R37.1 23.88,42.14 23.73,42.29 20.82,42.29 10.97,52.13 10.97,60.92 14.05,64 14.05,70.13 16.05,72.14 IC9.8
SEMC_D5
  Top 0.305: IC7.13 29.81,41.26 27.89,43.18 22.52,43.18 R38.2 R38.1 20.43,44.27 19.44,44.27 11.4,52.31 11.4,60.74 14.48,63.82 14.48,67.77 17.25,70.53 IC9.10
SEMC_D6
  Top 0.305: IC7.12 29.92,41.76 27.99,43.69 25.49,43.69 R39.2 R39.1 23.48,44.7 19.62,44.7 11.84,52.49 11.84,60.56 14.91,63.64 14.91,66.85 16.38,68.33 16.38,69.06 17.06,69.73 IC9.11
SEMC_D7
  Top 0.305: IC7.10 31.31,42.76 29.59,44.48 R40.2 R40.1 26.3,45.14 19.8,45.14 12.27,52.67 12.27,60.39 15.34,63.46 15.34,66.67 16.8,68.14 IC9.13
SEMC_D8
  Top 0.305: IC7.124 48.01,51.62 49.2,52.81 49.2,53.56 49.65,54.01 49.65,56.43 R19.1 R19.2 49.48,57.65 49.48,68.3 48.64,69.14 34.87,69.14 33.96,68.22 31.08,68.22 IC9.42
SEMC_D9
  Top 0.305: IC7.123 48.51,51.51 49.63,52.63 49.63,53.38 50.54,54.29 50.54,59.15 R18.1 R18.2 50.49,60.29 50.49,68.1 48.86,69.73 IC9.44
SEMC_D10
  Top 0.305: IC7.122 49.01,51.4 50.06,52.45 50.06,53.2 51.51,54.64 51.51,56.71 R17.1 R17.2 51.51,57.85 51.51,67.94 48.9,70.56 31.01,70.56 IC9.45
SEMC_D11
  Top 0.305: IC7.121 49.51,51.11 50.49,52.09 50.49,53.02 52.55,55.08 R16.1 R16.2 52.55,67.72 48.13,72.14 IC9.47
SEMC_D12
  Top 0.305: IC7.120 50.01,50.8 50.93,51.72 50.93,52.84 53.52,55.43 R15.1 R15.2 53.52,67.69 48.27,72.94 IC9.48
SEMC_D13
  Top 0.305: IC7.119 50.51,50.69 51.36,51.54 51.36,52.66 54.66,55.96 R14.1 R14.2 54.66,67.35 47.48,74.53 IC9.50
SEMC_D14
  Top 0.305: IC7.118 51.01,50.45 51.89,51.33 51.89,52.56 55.73,56.4 R13.1 R13.2 55.73,67.08 47.47,75.33 IC9.51
SEMC_D15
  Top 0.305: IC7.117 51.51,50.29 52.32,51.1 52.32,52.15 56.79,56.62 R12.1 R12.2 56.77,63.03 56.77,66.85 47.73,75.89 33.98,75.89 32.95,76.94 IC9.53
SEMC_DM0
  Top 0.305: IC7.9 31.67,43.26 29.36,45.57 22.27,45.57 R41.2 R41.1 20.1,46.74 18.81,46.74 12.7,52.85 12.7,60.21 18.92,66.43 18.92,66.45 19.01,66.53 IC9.15
SEMC_DM1
  Top 0.305: IC7.125 47.51,51.85 48.56,52.91 48.56,59.29 R20.1 R20.2 48.54,63.8 46.61,65.73 IC9.39
SEMC_RAS
  Top 0.305: IC7.4 34.02,45.76 33.04,46.74 30.93,46.74 29.64,48.03 20.95,48.03 R44.2 R44.1 18.37,49.61 17.77,49.61 13.99,53.38 13.99,59.1 18.95,64.06 18.95,64.14 IC9.18
SEMC_WE
  Top 0.305: IC7.8 31.96,43.76 29.64,46.08 25.21,46.08 R42.2 R42.1 23.12,47.17 18.99,47.17 13.13,53.03 13.13,59.84 19,65.71 19.02,65.73 IC9.16
SPI1_EN0
  Top 0.305: IC7.92 57.51,39.25 59.27,39.25 62.87,42.84 62.87,71.53 61.45,72.95 58.8,72.95 56.48,75.27 51.42,75.27 48.9,77.8 38.83,77.8 36.83,79.81 33.91,79.81 32.59,81.13 27.17,81.13 25.35,82.95 25.35,84.51 H1.9
SPI1_EN1  (via drill 0.35)
  Top 0.305: IC7.91 59.4,38.77 63.3,42.66 63.3,71.71 61.63,73.38 58.98,73.38 56.19,76.17 v52.78,76.17 | H1.10 26.62,80.7 32.41,80.7 33.73,79.38 36.65,79.38 38.66,77.37 48.41,77.37 51.18,74.6 v51.66,74.6
  Route15 0.305: v51.66,74.6 51.66,75.06 v52.78,76.17
SPI1_EN2  (via drill 0.35)
  Top 0.305: IC7.90 57.52,38.27 59.52,38.27 63.73,42.49 63.73,71.97 61.88,73.81 59.33,73.81 v58.83,74.32 | H1.22 40.95,81.61 v40.95,80.88
  Route15 0.305: v40.95,80.88 42.45,79.38 53.77,79.38 v58.83,74.32
SPI1_EN3  (via drill 0.35)
  Top 0.305: IC7.89 57.51,37.75 59.6,37.75 64.16,42.31 64.16,72.43 v62.2,74.39 | H1.21 40.69,84.41 40.69,82.55 v42.37,80.88
  Route15 0.305: v42.37,80.88 53.35,80.88 59.74,74.49 62.1,74.49 v62.2,74.39
SPI1_MISO  (via drill 0.35)
  Top 0.305: IC7.95 57.52,40.77 58.96,40.77 61.57,43.38 61.57,67.34 60.87,68.04 60.87,69.97 61.37,70.46 v61.37,71.91 | H1.18 34.29,82.42 35.46,81.25 37.21,81.25 39.24,79.22 50.68,79.22 51.19,78.72 v52.78,78.72
  Route15 0.305: v61.37,71.91 60.86,72.42 59.72,72.42 53.42,78.72 v52.78,78.72
SPI1_MOSI  (via drill 0.35)
  Top 0.305: IC7.96 57.52,41.27 58.85,41.27 61.14,43.56 61.14,67.16 60.44,67.86 60.44,71.54 v60.43,71.55 | H1.16 34.27,80.67 37.19,80.67 39.12,78.74 49.97,78.74 50.57,78.14 v50.57,78.11
  Route15 0.305: v60.43,71.55 59.74,71.55 53.19,78.11 v50.57,78.11
SPI1_PCS0
  Top 0.305: IC7.97 57.52,41.77 58.74,41.77 60.71,43.74 60.71,65.99 58.2,68.5 56.49,68.5 48.06,76.94 38.48,76.94 36.47,78.94 33.55,78.94 32.23,80.26 26.45,80.26 25.3,81.41 24.35,81.41 22.89,82.87 22.89,84.44 H1.7
SPI1_PCS1  (via drill 0.35)
  Top 0.305: IC7.88 59.73,37.27 64.59,42.13 64.59,73.22 62.21,75.6 61.52,75.6 v61.27,75.34 | H1.8 23.8,80.97 25.12,80.97 26.27,79.83 32.05,79.83 33.38,78.51 36.29,78.51 38.35,76.45 47.85,76.45 57.66,66.65 v57.66,65.79
  Route15 0.305: v61.27,75.34 61.29,75.31 62.07,75.31 63.25,74.13 63.25,72.52 59.99,69.27 59.99,68.12 v57.66,65.79
SPI1_PCS2
  Top 0.305: IC7.87 57.51,36.75 59.82,36.75 65.02,41.95 65.02,73.43 60.78,77.67 57.12,77.67 55.14,79.65 53.91,79.65 53.9,79.65 39.62,79.65 36.83,82.45 H1.20
SPI1_PCS3
  Top 0.305: IC7.84 58.94,35.25 65.46,41.77 65.46,73.61 60.96,78.11 57.3,78.11 55.32,80.09 40.51,80.09 38.08,82.53 38.08,84.48 H1.19
SPI1_SCK  (via drill 0.35)
  Top 0.305: IC7.98 58.62,42.27 60.27,43.92 60.27,65.46 58.07,67.67 v57.86,67.67 | H1.12 28.3,81.56 32.77,81.56 34.09,80.24 37.01,80.24 38.99,78.26 47.48,78.26 49.51,78.26 50.32,77.44 v52.53,77.44
  Route15 0.305: v57.86,67.67 59.49,69.29 59.49,71.02 53.06,77.44 v52.53,77.44
UART1_RX  (via drill 0.35)
  Top 0.305: IC7.101 58.28,43.75 58.95,44.43 58.95,54.26 58.47,54.74 v56.16,54.74 | v14.78,80.47 14.78,81.46 H1.4
  Route15 0.305: v56.16,54.74 35.38,75.51 28,75.51 23.81,79.7 15.54,79.7 v14.78,80.47
UART1_TX  (via drill 0.35)
  Top 0.305: IC7.105 58.29,45.77 58.52,46 58.52,53.52 57.96,54.08 55.83,54.08 v55.45,53.7 | v12.78,80.42 12.78,82 H1.2
  Route15 0.305: v55.45,53.7 34.19,74.95 27.8,74.95 23.56,79.2 13.99,79.2 v12.78,80.42
UART3_RX  (via drill 0.35)
  Top 0.305: IC7.93 59.18,39.77 62.43,43.02 62.43,68.38 v61.9,68.91 | H1.52 77.47,81.69 74.55,78.77 73.89,78.77 v70.31,75.18
  Route15 0.305: v61.9,68.91 68.17,75.18 v70.31,75.18
UART3_TX  (via drill 0.35)
  Top 0.305: IC7.94 57.51,40.25 59.05,40.25 62,43.2 62,67.52 61.31,68.22 61.31,69.56 62.03,70.28 v62.1,70.28 | v70.41,77.34 73.43,80.37 73.46,80.37 74.93,81.84 H1.50
  Route15 0.305: v62.1,70.28 67.59,75.77 69.93,75.77 70.41,76.25 v70.41,77.34
UART4_RX  (via drill 0.35)
  Top 0.305: IC7.79 57.51,32.75 59.49,32.75 67.61,40.88 67.61,75.21 v64.14,78.69 | H1.3 16.59,85.73 17.82,84.5 19.46,84.5 20.37,83.58 20.37,81.89 21.31,80.95 v22.55,80.95
  Route15 0.305: v64.14,78.69 63.37,78.69 61.65,80.42 55.55,80.42 54.08,81.89 23.5,81.89 v22.55,80.95
UART4_TX  (via drill 0.35)
  Top 0.305: IC7.80 57.52,33.27 59.4,33.27 67.18,41.05 67.18,74.86 v64.15,77.89 | v24.79,80.31 18.85,80.31 17.84,81.32 17.84,83.57 17.12,84.29 15.41,84.29 H1.1
  Route15 0.305: v64.15,77.89 63.51,77.89 61.42,79.98 55.37,79.98 53.92,81.43 25.91,81.43 v24.79,80.31
USB_OTG1_CHD
  Top 0.305: IC7.66 52.51,25.85 53.52,24.84 TP5.TP
VDD_HIGH_CAP
  Top 0.305: IC7.65 52.01,25.48 54.06,23.43 C23.2 54.63,23.41 C24.2
VDD_SNVS_CAP
  Top 0.305: IC7.56 47.51,25.4 C21.2
VDD_USB_3V
  Top 0.305: IC7.61 50.01,26.99 51.46,25.54 C4.2 51.89,24.35 C14.2
VSD_3V3
  Top 0.305: 74.93,31.27 C38.2 | 73.18,31.3 C49.2 73.13,31.3 | IC8.3 75.41,29.45
  Top 0.406: 74.93,31.27 IC8.3
  Top 0.61: J1.4 76.03,14.36 76.63,14.96 76.63,17.6 74.7,19.53 74.7,24.87 76.96,27.13 76.96,28.71 76.22,29.45 75.41,29.45 | C38.2 73.18,31.3 | 73.13,31.3 C52.2
WAKEUP
  Top 0.305: IC7.52 TP8.TP
XTALI
  Top 0.305: IC7.67 53,26.39 54.62,24.78 56.37,24.78 56.39,24.79 57.76,24.79 57.84,24.71 57.84,22.45 58.52,22.45 Y1.3 59.14,22.06 R10.1 59.27,20.09 C39.2
XTALO
  Top 0.305: IC7.68 53.5,26.5 54.8,25.21 56.2,25.21 57.19,26.2 59.36,26.2 59.88,25.68 C40.2 59.98,25.27 Y1.1

## Text on the board
tNames: 5V | GND | GND | SDRAM | JTAG | BIG | BRAIN | GND | GND | FLASH | GND
bNames: UW AACT | SOC-i | CDH TEAM | OBC | REV. 0 | HW: JONATHAN CASAMAYOR